# EAGLE schematic MDBT53BD_01 (EAGLE 7.7.0)

## Sheet 1 of 3
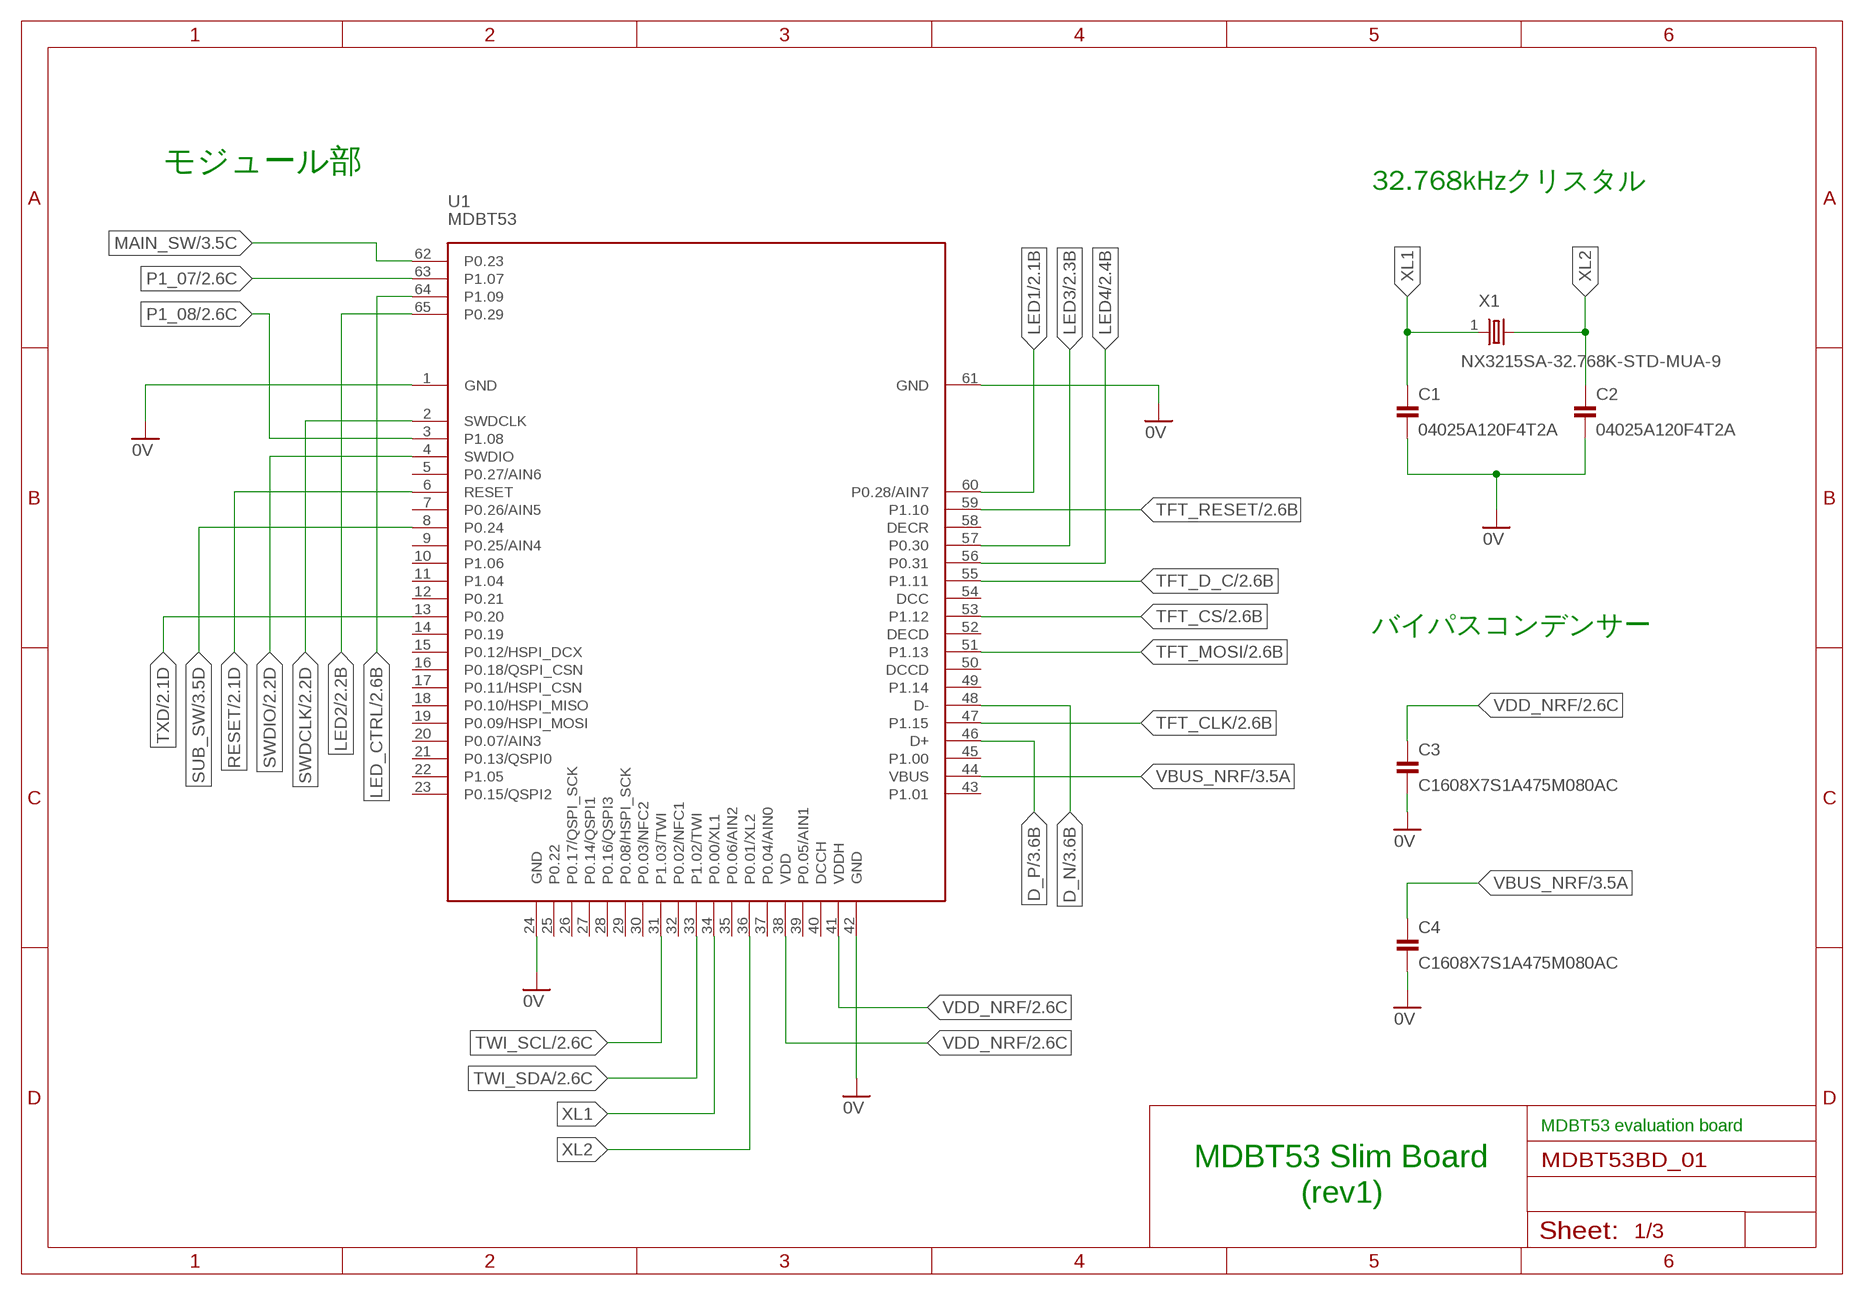
[diagram p0: schematic, sheet 1]

### Parts
C1  04025A120F4T2A  CAP_0402K  [C0402K]
C2  04025A120F4T2A  CAP_0402K  [C0402K]
C3  C1608X7S1A475M080AC  CAP_0603N  [C0603N]
C4  C1608X7S1A475M080AC  CAP_0603N  [C0603N]
U1  MDBT53  [MDBT53]
X1  NX3215SA-32.768K-STD-MUA-9  [NX3215]

### Nets
0V: C1.2 C2.2 C3.2 C4.2 U1.1(GND) U1.24(GND) U1.42(GND) U1.61(GND) ; also sheet 2,3
D_N: U1.48(D-) ; also sheet 3
D_P: U1.46(D+) ; also sheet 3
LED1: U1.60(P0.28/AIN7) ; also sheet 2
LED2: U1.65(P0.29) ; also sheet 2
LED3: U1.57(P0.30) ; also sheet 2
LED4: U1.56(P0.31) ; also sheet 2
LED_CTRL: U1.64(P1.09) ; also sheet 2
MAIN_SW: U1.62(P0.23) ; also sheet 3
P1_07: U1.63(P1.07) ; also sheet 2
P1_08: U1.3(P1.08) ; also sheet 2
RESET: U1.6(RESET) ; also sheet 2
SUB_SW: U1.8(P0.24) ; also sheet 3
SWDCLK: U1.2(SWDCLK) ; also sheet 2
SWDIO: U1.4(SWDIO) ; also sheet 2
TFT_CLK: U1.47(P1.15) ; also sheet 2
TFT_CS: U1.53(P1.12) ; also sheet 2
TFT_D_C: U1.55(P1.11) ; also sheet 2
TFT_MOSI: U1.51(P1.13) ; also sheet 2
TFT_RESET: U1.59(P1.10) ; also sheet 2
TWI_SCL: U1.31(P1.03/TWI) ; also sheet 2
TWI_SDA: U1.33(P1.02/TWI) ; also sheet 2
TXD: U1.13(P0.20) ; also sheet 2
VBUS_NRF: C4.1 U1.44(VBUS) ; also sheet 3
VDD_NRF: C3.1 U1.38(VDD) U1.41(VDDH) ; also sheet 2,3
XL1: C1.1 U1.34(P0.00/XL1) X1.1
XL2: C2.1 U1.36(P0.01/XL2) X1.2
Unconnected: U1.5(P0.27/AIN6) U1.7(P0.26/AIN5) U1.9(P0.25/AIN4) U1.10(P1.06) U1.11(P1.04) U1.12(P0.21) U1.14(P0.19) U1.15(P0.12/HSPI_DCX) U1.16(P0.18/QSPI_CSN) U1.17(P0.11/HSPI_CSN) U1.18(P0.10/HSPI_MISO) U1.19(P0.09/HSPI_MOSI) U1.20(P0.07/AIN3) U1.21(P0.13/QSPI0) U1.22(P1.05) U1.23(P0.15/QSPI2) U1.25(P0.22) U1.26(P0.17/QSPI_SCK) U1.27(P0.14/QSPI1) U1.28(P0.16/QSPI3) U1.29(P0.08/HSPI_SCK) U1.30(P0.03/NFC2) U1.32(P0.02/NFC1) U1.35(P0.06/AIN2) U1.37(P0.04/AIN0) U1.39(P0.05/AIN1) U1.40(DCCH) U1.43(P1.01) U1.45(P1.00) U1.49(P1.14) U1.50(DCCD) U1.52(DECD) U1.54(DCC) U1.58(DECR)

### Notes on the sheet
- モジュール部
- 32.768kHzクリスタル
- バイパスコンデンサー
- MDBT53 evaluation board
- MDBT53 Slim Board
- (rev1)

## Sheet 2 of 3
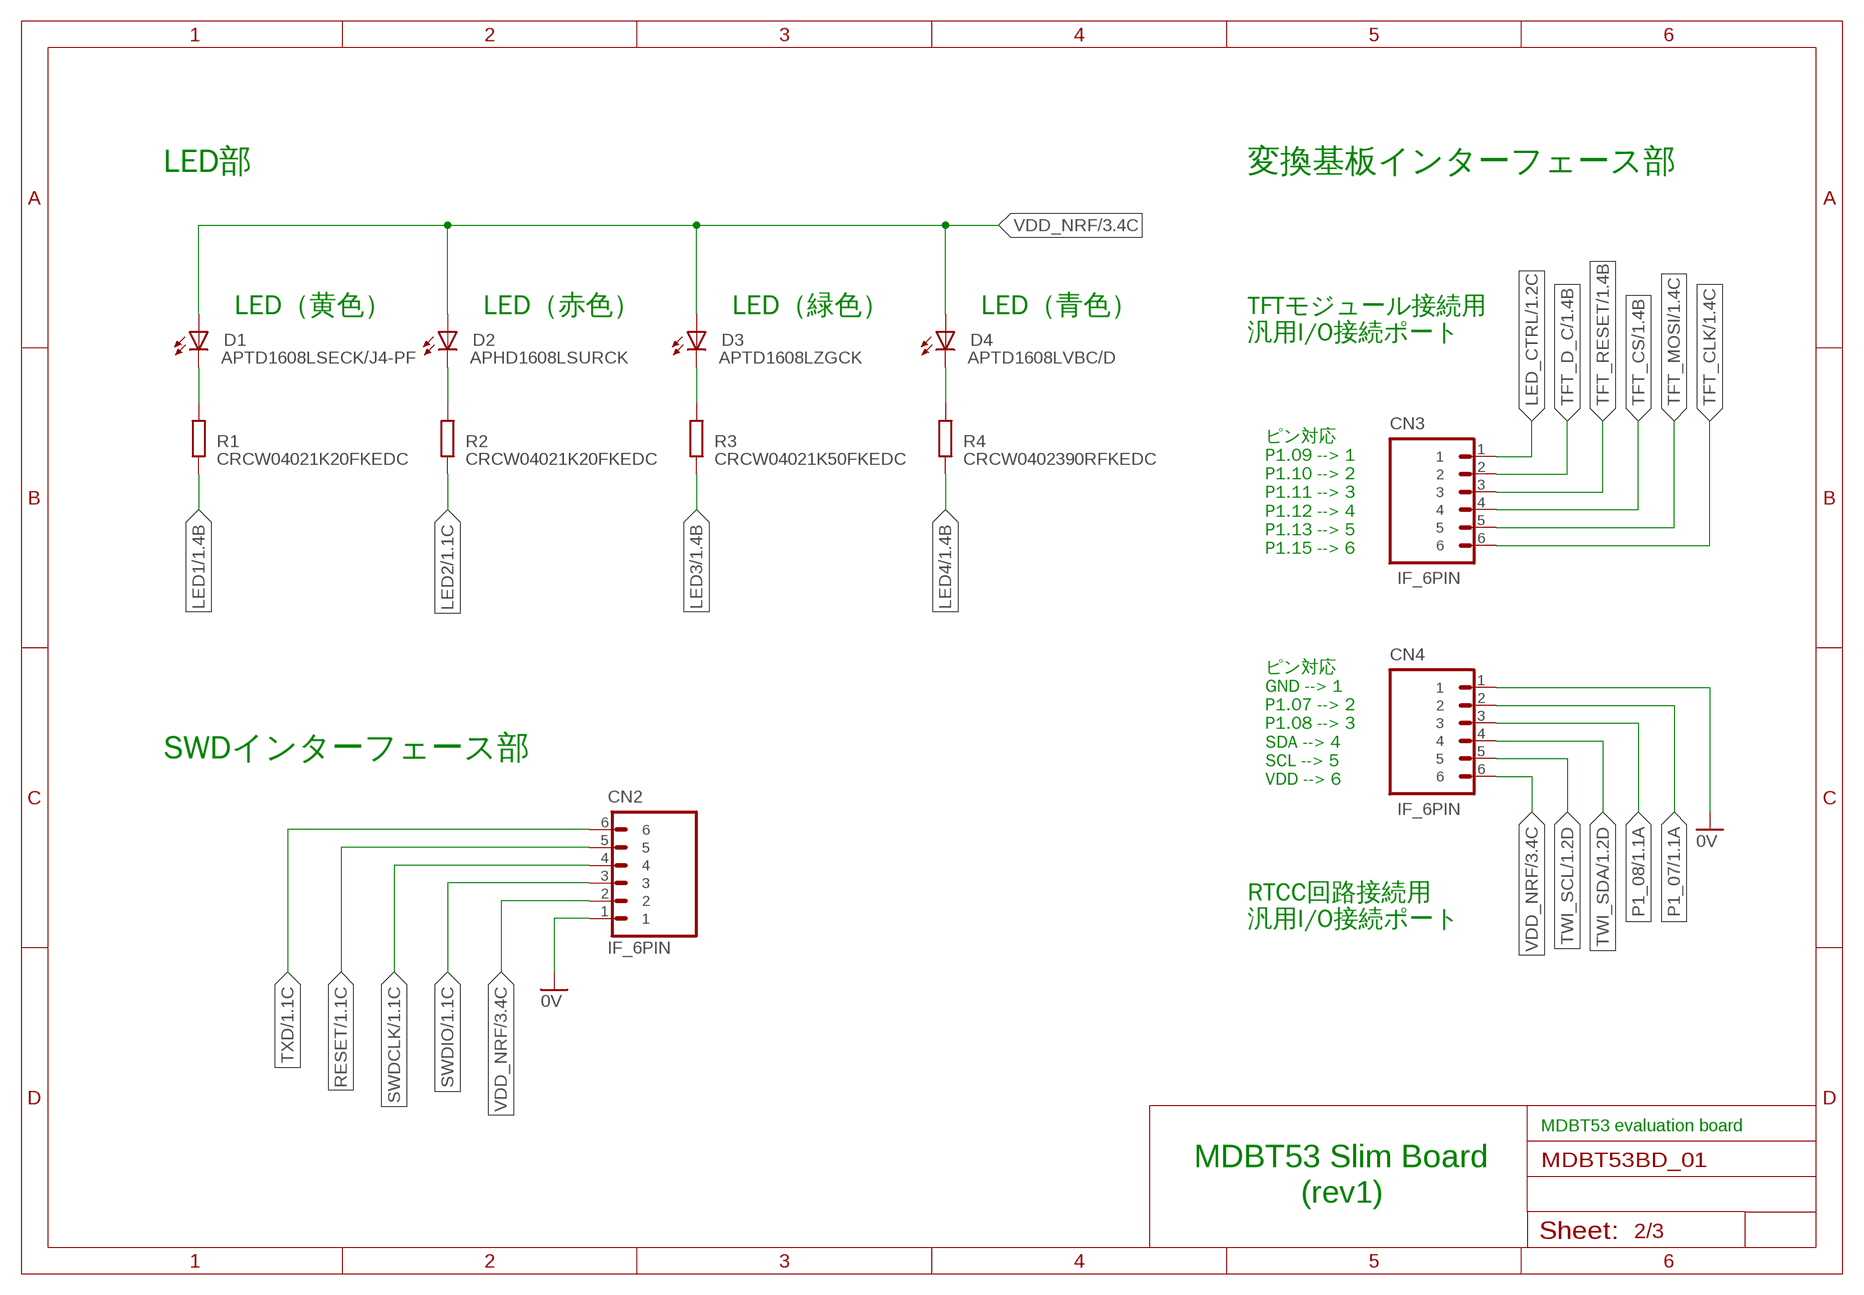
[diagram p1: schematic, sheet 2]

### Parts
CN2  IF_6PIN  [HEADER_6PIN]
CN3  IF_6PIN  [HEADER_6PIN]
CN4  IF_6PIN  [HEADER_6PIN]
D1  APTD1608LSECK/J4-PF  [APTD1608]
D2  APHD1608LSURCK  [APTD1608]
D3  APTD1608LZGCK  [APTD1608]
D4  APTD1608LVBC/D  [APTD1608]
R1  CRCW04021K20FKEDC  RESISTOR_0402N  [R0402N]
R2  CRCW04021K20FKEDC  RESISTOR_0402N  [R0402N]
R3  CRCW04021K50FKEDC  RESISTOR_0402N  [R0402N]
R4  CRCW0402390RFKEDC  RESISTOR_0402N  [R0402N]

### Nets
0V: CN2.1 CN4.1 ; also sheet 1,3
LED1: R1.1 ; also sheet 1
LED2: R2.1 ; also sheet 1
LED3: R3.1 ; also sheet 1
LED4: R4.1 ; also sheet 1
LED_CTRL: CN3.1 ; also sheet 1
N$1: D1.C R1.2
N$4: D2.C R2.2
N$5: D3.C R3.2
N$6: D4.C R4.2
P1_07: CN4.2 ; also sheet 1
P1_08: CN4.3 ; also sheet 1
RESET: CN2.5 ; also sheet 1
SWDCLK: CN2.4 ; also sheet 1
SWDIO: CN2.3 ; also sheet 1
TFT_CLK: CN3.6 ; also sheet 1
TFT_CS: CN3.4 ; also sheet 1
TFT_D_C: CN3.2 ; also sheet 1
TFT_MOSI: CN3.5 ; also sheet 1
TFT_RESET: CN3.3 ; also sheet 1
TWI_SCL: CN4.5 ; also sheet 1
TWI_SDA: CN4.4 ; also sheet 1
TXD: CN2.6 ; also sheet 1
VDD_NRF: CN2.2 CN4.6 D1.A D2.A D3.A D4.A ; also sheet 1,3

### Notes on the sheet
- LED部 | 変換基板インターフェース部
- TFTモジュール接続用
  汎用I/O接続ポート
- LED（黄色） | LED（赤色） | LED（緑色） | LED（青色）
- ピン対応
  P1.09 --> 1
  P1.10 --> 2
  P1.11 --> 3
  P1.12 --> 4
  P1.13 --> 5
  P1.15 --> 6
- ピン対応
  GND --> 1
  P1.07 --> 2
  P1.08 --> 3
  SDA --> 4
  SCL --> 5
  VDD --> 6
- SWDインターフェース部
- RTCC回路接続用
  汎用I/O接続ポート
- MDBT53 evaluation board
- MDBT53 Slim Board
- (rev1)

## Sheet 3 of 3
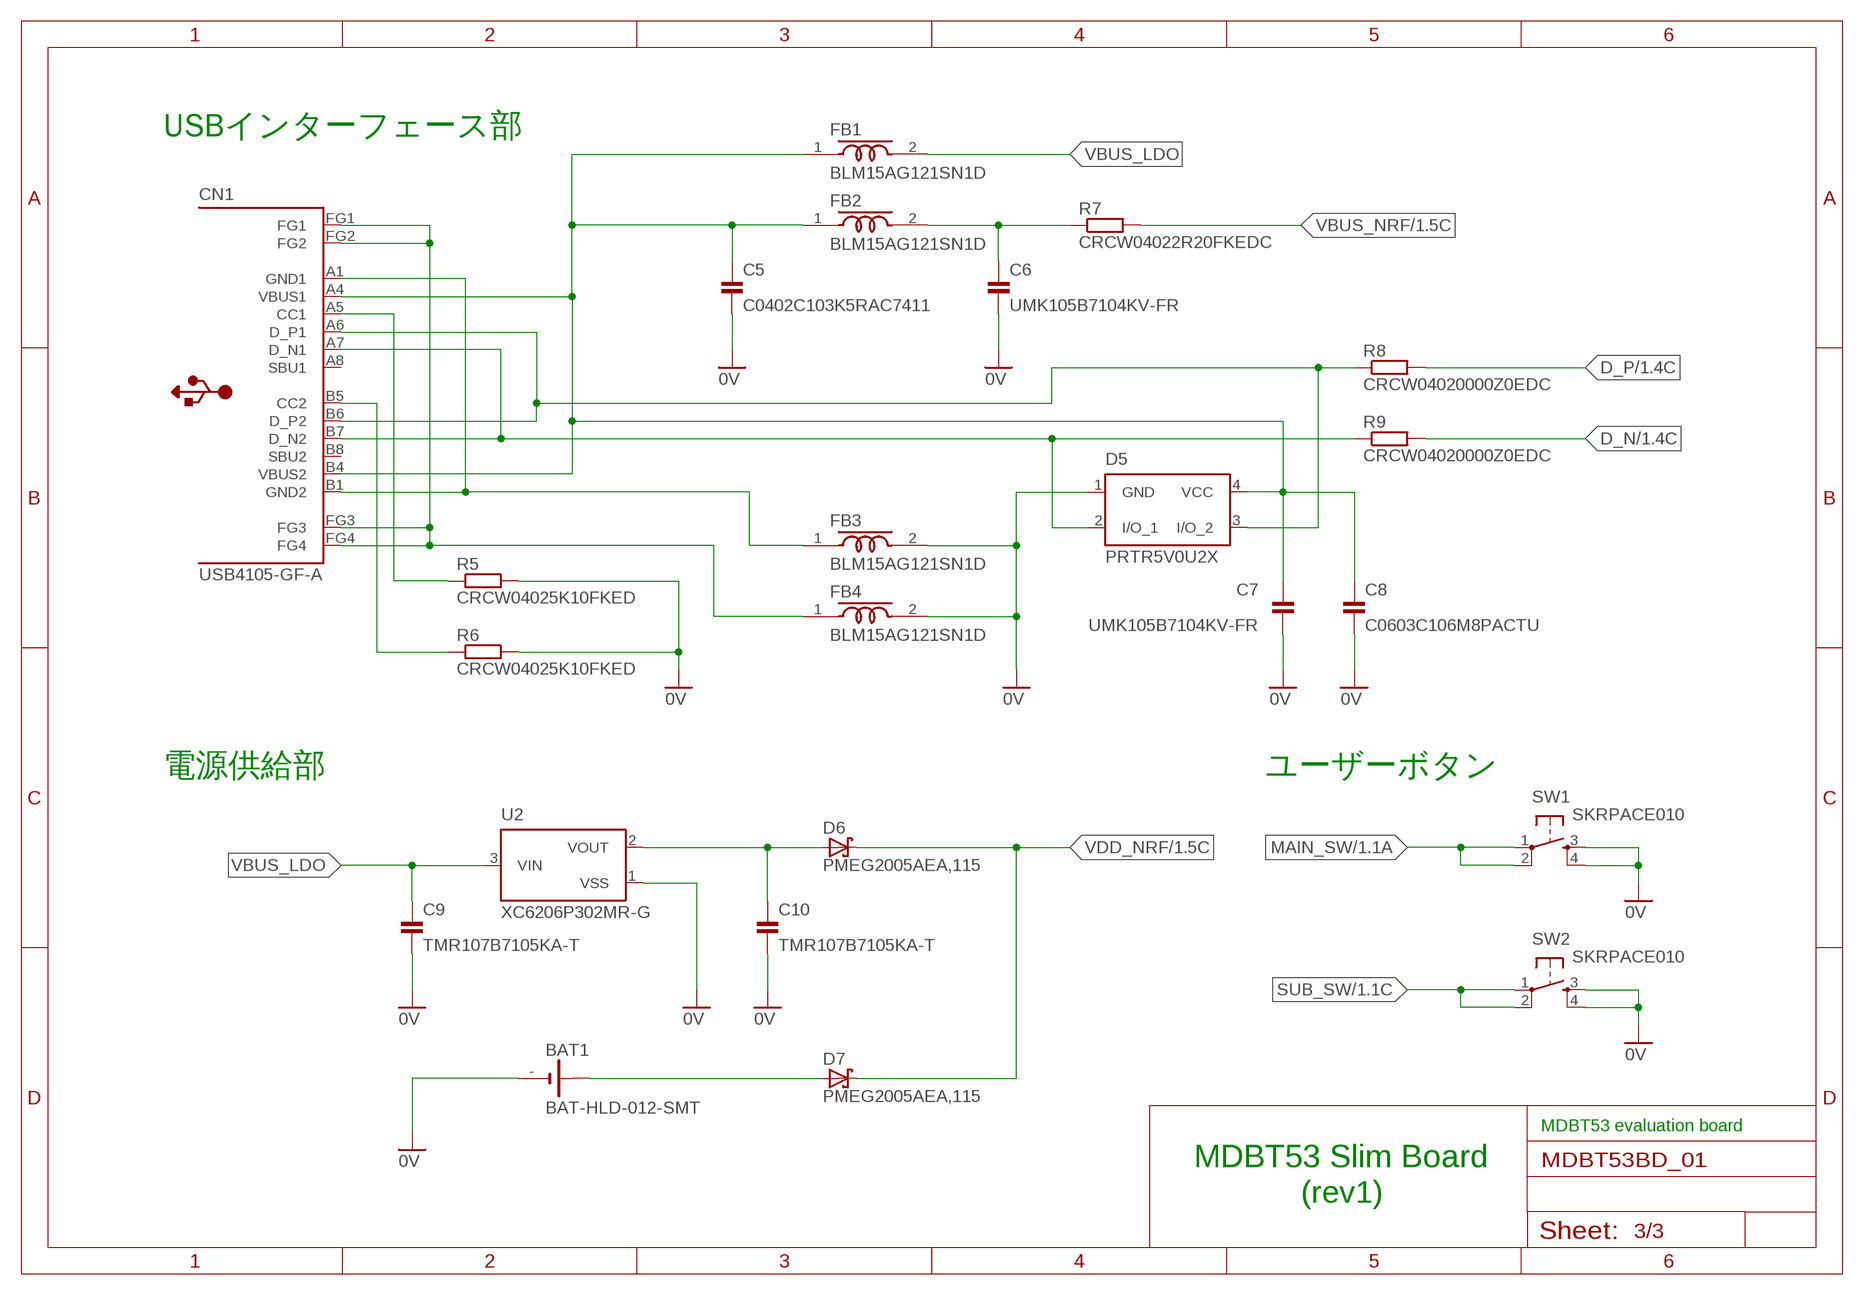
[diagram p2: schematic, sheet 3]

### Parts
BAT1  BAT-HLD-012-SMT  [BAT-HLD-012-SMT]
C5  C0402C103K5RAC7411  CAP_0402N  [C0402N]
C6  UMK105B7104KV-FR  CAP_0402N  [C0402N]
C7  UMK105B7104KV-FR  CAP_0402N  [C0402N]
C8  C0603C106M8PACTU  CAP_0603N  [C0603N]
C9  TMR107B7105KA-T  CAP_0603N  [C0603N]
C10  TMR107B7105KA-T  CAP_0603N  [C0603N]
CN1  USB4105-GF-A  [USB4105-GF-A]
D5  PRTR5V0U2X  [SOT143B]
D6  PMEG2005AEA,115  [SOD323-W]
D7  PMEG2005AEA,115  [SOD323-W]
FB1  BLM15AG121SN1D  [C0402N]
FB2  BLM15AG121SN1D  [C0402N]
FB3  BLM15AG121SN1D  [C0402N]
FB4  BLM15AG121SN1D  [C0402N]
R5  CRCW04025K10FKED  RESISTOR_0402N  [R0402N]
R6  CRCW04025K10FKED  RESISTOR_0402N  [R0402N]
R7  CRCW04022R20FKEDC  RESISTOR_0402N  [R0402N]
R8  CRCW04020000Z0EDC  RESISTOR_0402N  [R0402N]
R9  CRCW04020000Z0EDC  RESISTOR_0402N  [R0402N]
SW1  SKRPACE010  [SKRPACE010]
SW2  SKRPACE010  [SKRPACE010]
U2  XC6206P302MR-G  [SOT23]

### Nets
0V: BAT1.- C5.2 C6.2 C7.2 C8.2 C9.2 C10.2 D5.1(GND) FB3.2 FB4.2 R5.2 R6.2 SW1.3(S) SW1.4(S1) SW2.3(S) SW2.4(S1) U2.1(VSS) ; also sheet 1,2
D_N: R9.2 ; also sheet 1
D_P: R8.2 ; also sheet 1
MAIN_SW: SW1.1(P) SW1.2(P1) ; also sheet 1
N$7: CN1.B5(CC2) R6.1
N$8: C10.1 D6.A U2.2(VOUT)
N$9: BAT1.+@2(+) D7.A
N$10: CN1.A5(CC1) R5.1
N$11: CN1.FG1 CN1.FG2 CN1.FG3 CN1.FG4 FB4.1
N$12: CN1.A1(GND1) CN1.B1(GND2) FB3.1
N$13: C6.1 FB2.2 R7.1
N$16: CN1.A7(D_N1) CN1.B7(D_N2) D5.2(I/O_1) R9.1
N$17: C5.1 C7.1 C8.1 CN1.A4(VBUS1) CN1.B4(VBUS2) D5.4(VCC) FB1.1 FB2.1
N$18: CN1.A6(D_P1) CN1.B6(D_P2) D5.3(I/O_2) R8.1
SUB_SW: SW2.1(P) SW2.2(P1) ; also sheet 1
VBUS_LDO: C9.1 FB1.2 U2.3(VIN)
VBUS_NRF: R7.2 ; also sheet 1
VDD_NRF: D6.C D7.C ; also sheet 1,2
Unconnected: CN1.A8(SBU1) CN1.B8(SBU2)

### Notes on the sheet
- USBインターフェース部
- 電源供給部 | ユーザーボタン
- MDBT53 evaluation board
- MDBT53 Slim Board
- (rev1)

## Library data of the parts
BAT1 = Connectors:BAT-HLD-012-SMT: ボタン電池ホルダー(CR1216/1225)
C1-C10 = Parts:CAP: コンデンサー
CN1 = Connectors:USB4105-GF-A: USB Type C Receptacle for USB 2.0
CN2-CN4 = Connectors:IF_6PIN: 6-pin インターフェース
D1 D3 D4 = Parts:APTD1608: 発光ダイオード
D2 = Parts:APHD1608: 発光ダイオード
D5 = Parts:PRTR5V0U2X: ESD protection diode
D6 D7 = Parts:PMEG2005: ショットキーダイオード If - 順電流: 500 mA Vrrm - 繰返し逆電圧: 20 V Vf - 順電圧: 0.39 V Ifsm - 順方向サージ電流: 10 A 最低動作温度: - 65 C 最高動作温度: + 150 C
FB1-FB4 = Parts:BLM15AG: フェライトビーズ EMIFIL®
R1-R9 = Parts:RESISTOR: 抵抗器
SW1 SW2 = Parts:SKRPACE010: 表面実装用タクトスイッチ ４．２×３．２ｍｍ小型重作動力タイプ ・作動力：２．５５Ｎ ・操作方向：垂直 ・移動量：０．２ｍｍ ・動作寿命：５０，０００ｃｙｃｌｅｓ （５ｍＡ ５ＶＤＣ） ・初期接触抵抗：最大５００ｍΩ
U1 = MDBT53_210707:MDBT53: Raytac Corporation Part Number: MDBT53-1M / MDBT53-P1M / MDBT53-U1M Bluetooth Low Energy Module based on Noridc nRF5340 Size: 14.3x9.3mm Source: Raytac datasheet
U2 = Parts:XC6206: 電圧レギュレータ 出力電圧: 3.3 V 出力電流: 200 mA 入力電圧最大値: 6 V 最小入力電圧: 1.8 V 動作供給電流: 1 uA 最低動作温度: - 40 C 最高動作温度: + 85 C
X1 = Parts:NX3215SA: 水晶振動子 周波数 32.768kHz 周波数公差 ±20ppm 負荷容量 6pF ESR（等価直列抵抗） 70 kOhms 動作温度 -40°C～85°C